# Altium schematic sheet ESP.SchDoc
size A4; SheetNumber: 1; SheetTotal: 7
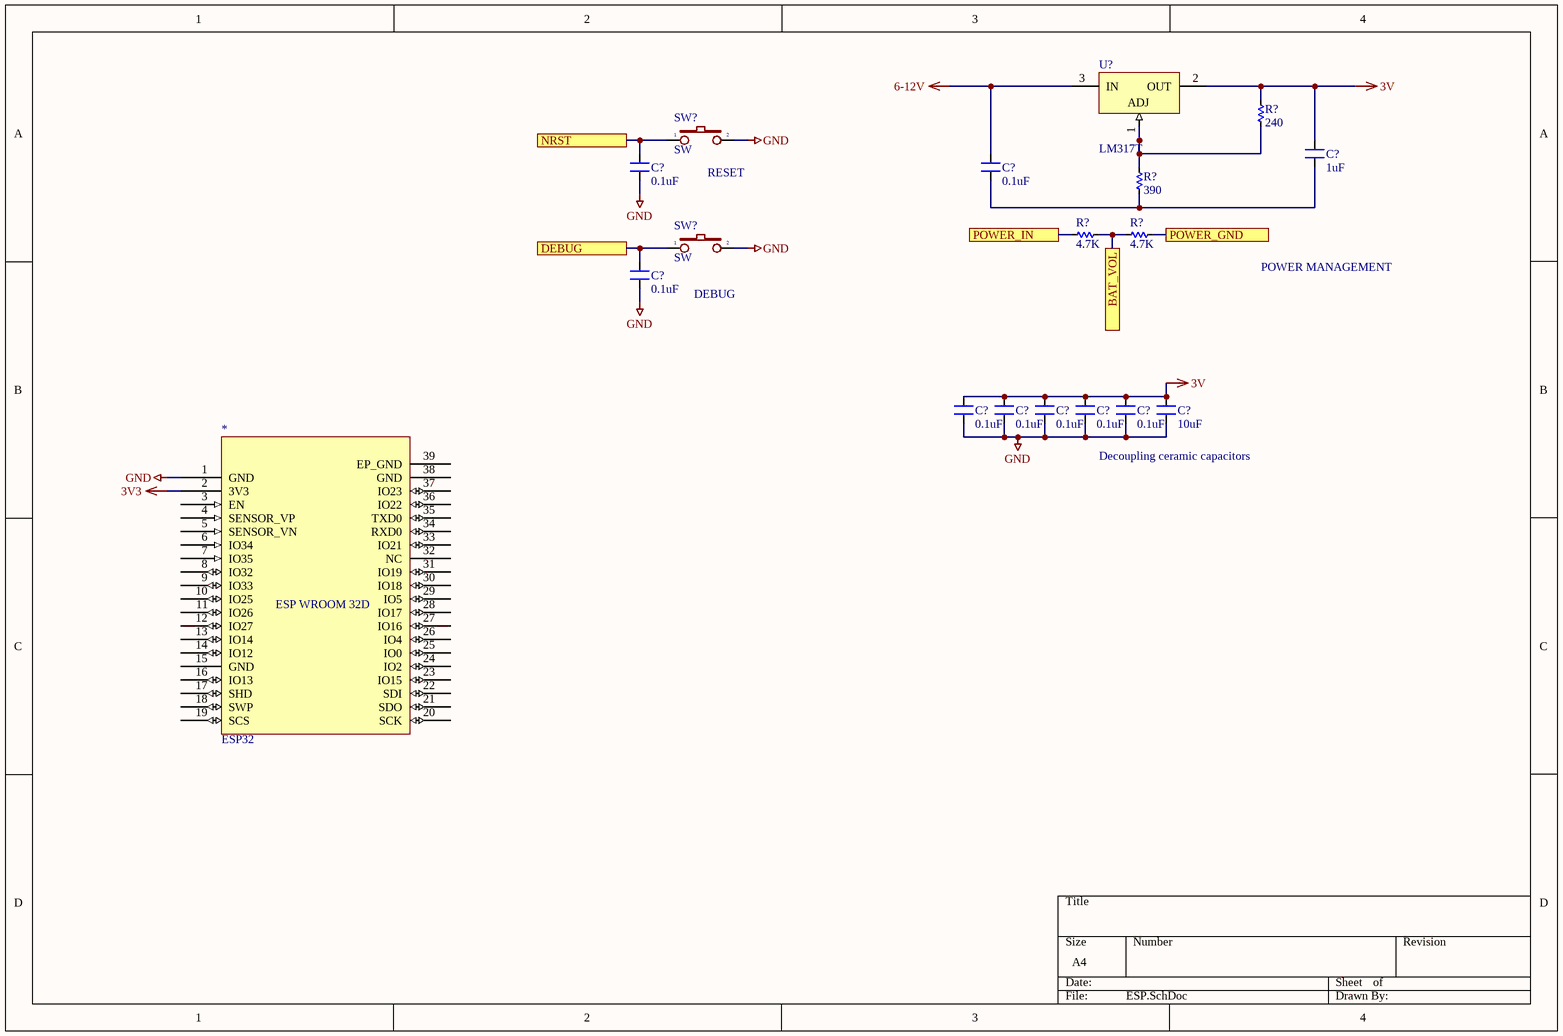
[diagram p0: ESP.SchDoc]

## Parts
(Parts that share a designator on the sheet are numbered #1, #2 ... from top to bottom, then left to right.)
*  ESP32  [ESP32-WROOM-32D]
C?#1  1uF  [C-SE-7,5x10x9x5x4]
C?#2  0.1uF  [C-SE-7,5x10x9x5x4]
C?#3  0.1uF  [C-SE-7,5x10x9x5x4]
C?#4  0.1uF  [C-SE-7,5x10x9x5x4]
C?#5  0.1uF  [C-SE-7,5x10x9x5x4]
C?#6  0.1uF  [C-SE-7,5x10x9x5x4]
C?#7  0.1uF  [C-SE-7,5x10x9x5x4]
C?#8  0.1uF  [C-SE-7,5x10x9x5x4]
C?#9  0.1uF  [C-SE-7,5x10x9x5x4]
C?#10  10uF  [C-SE-7,5x10x9x5x4]
R?#1  240  [RES-1/2W]
R?#2  390  [RES-1/2W]
R?#3  4.7K  [RES-1/2W]
R?#4  4.7K  [RES-1/2W]
SW?#1  SW  [SW1-SMD]
SW?#2  SW  [SW1-SMD]
U?  LM317T  [TO-220]

## Ports
BAT_VOL, DEBUG, NRST, POWER_GND, POWER_IN

## Nets
3V: C?#1.2 C?#5.2 C?#6.2 C?#7.2 C?#8.2 C?#9.2 C?#10.2 R?#1.1 U?.2(OUT)
3V3: *.2(3V3)
6-12V: C?#3.2 U?.3(IN)
GND: *.1(GND) C?#2.1 C?#4.1 C?#5.1 C?#6.1 C?#7.1 C?#8.1 C?#9.1 C?#10.1 SW?#1.2 SW?#2.2
BAT_VOL: R?#3.2 R?#4.1 ; port BAT_VOL
DEBUG: C?#4.2 SW?#2.1 ; port DEBUG
NRST: C?#2.2 SW?#1.1 ; port NRST
POWER_GND: R?#4.2 ; port POWER_GND
POWER_IN: R?#3.1 ; port POWER_IN
NetC?#1_1: C?#1.1 C?#3.1 R?#2.2
NetR?#1_2: R?#1.2 R?#2.1 U?.1(ADJ)

Not connected (* = marked no-connect by the designer): * 3(EN) 4(SENSOR_VP) 5(SENSOR_VN) 6(IO34) 7(IO35) 8(IO32) 9(IO33) 10(IO25) 11(IO26) 12(IO27) 13(IO14) 14(IO12) 15(GND) 16(IO13) 17(SHD) 18(SWP) 19(SCS) 20(SCK) 21(SDO) 22(SDI) 23(IO15) 24(IO2) 25(IO0) 26(IO4) 27(IO16) 28(IO17) 29(IO5) 30(IO18) 31(IO19) 32(NC) 33(IO21) 34(RXD0) 35(TXD0) 36(IO22) 37(IO23) 38(GND) 39(EP_GND)

## Notes on the sheet
- (near SW?#1) RESET
- DEBUG
- POWER MANAGEMENT
- (near C?#9) Decoupling ceramic capacitors
- (in symbol Component_1) ESP WROOM 32D

## Library data of the parts
* = Component_1
C?#1-C?#10 = CN-SEMI-DIP: Capacitor (Semiconductor SIM Model); Value: 104; LatestRevisionDate: 17-Jul-2002; LatestRevisionNote: Re-released for DXP Platform.; PackageReference: C1206; Publisher: Altium Limited
R?#1-R?#4 = Res: Manufacturer: Generic Components; Class: Passive; SubClass: R; Published: 08/06/2000; Publisher: Altium Hobart Technology Centre
SW?#1 SW?#2 = SW2: Switch button 2 pin; Value: SW chip 2 pin
U? = CMP-0244-00444-1: 1.5A, 1.2V to 37V Adjustable Voltage Regulator, 3-Pin TO-220; PackageVersion: 2011; ComponentLink1URL: http://www.st.com; ComponentLink2URL: http://www.st.com/internet/com/TECHNICAL_RESOURCES/TECHNICAL_LITERATURE/DATASHEET/CD00000455.pdf; PackageDescription: TO, Thru-Hole, Vertical, Heatsink Mounted; 3 In-Line Leads; Pitch 2.54 mm; PackageReference: TO-220; ComponentLink1Description: Manufacturer URL; ComponentLink3URL: http://www.st.com/internet/com/TECHNICAL_RESOURCES/TECHNICAL_LITERATURE/PACKAGE_INFORMATION/CD00004649.pdf; DatasheetVersion: 1/11/2011; ComponentLink2Description: Datasheet; ComponentLink3Description: Package Specification